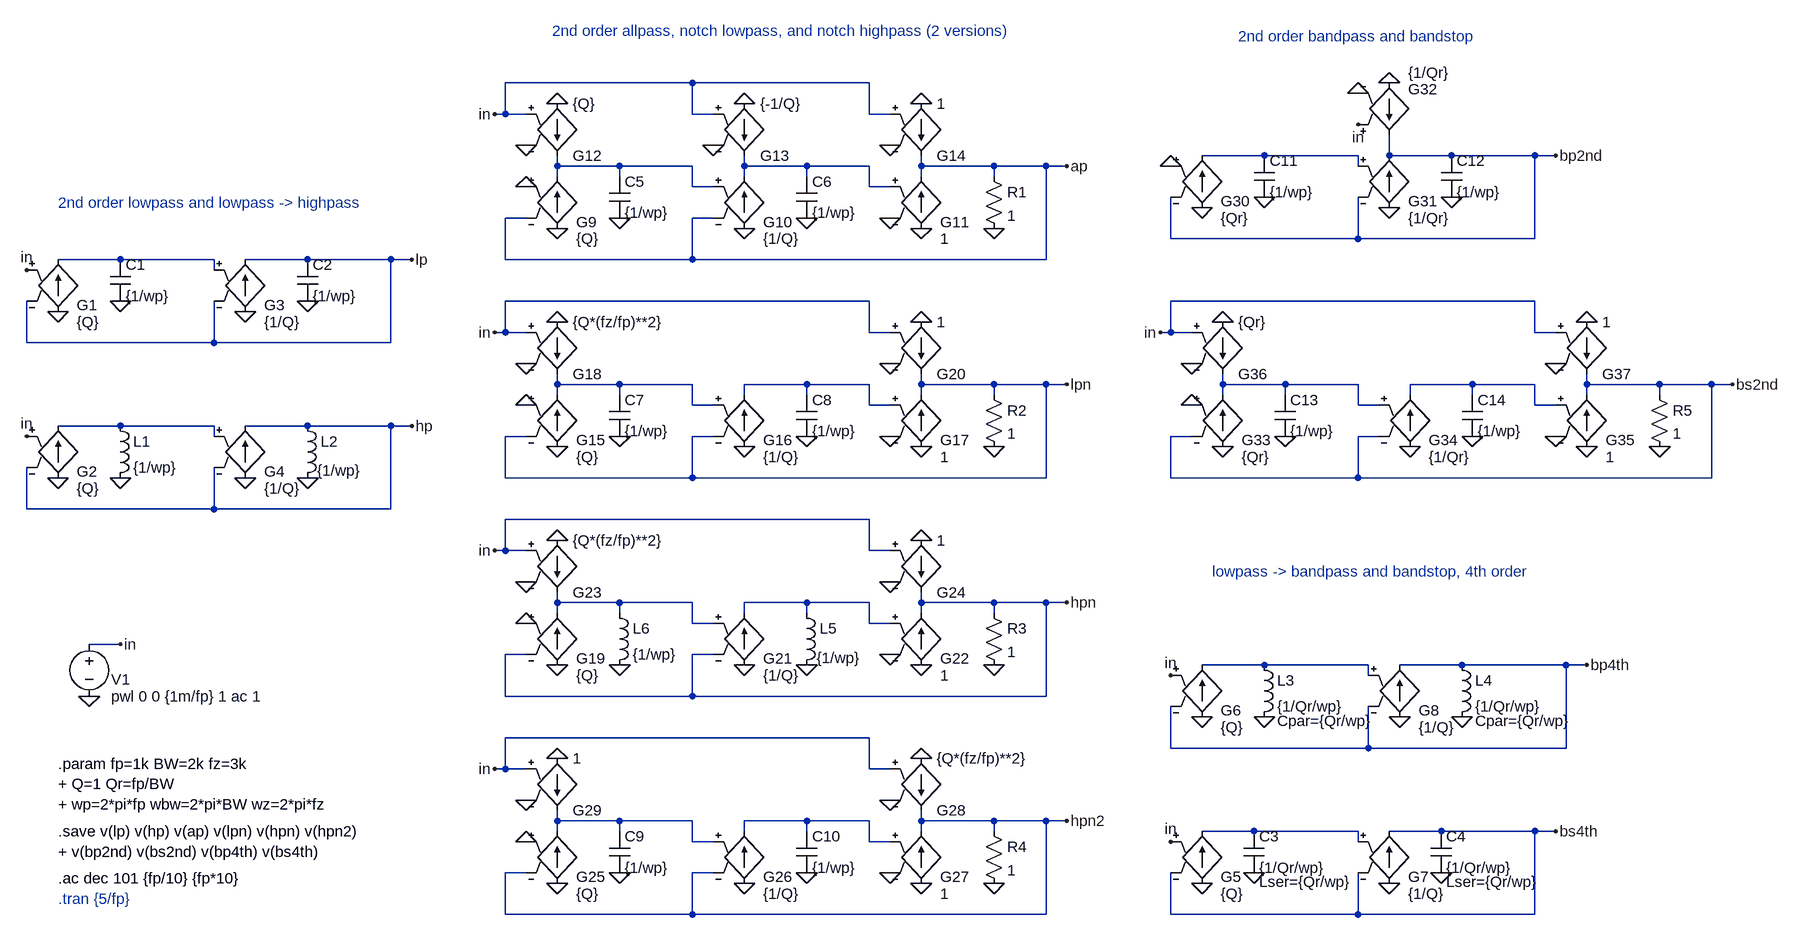
[diagram p0: schematic 2nd_lp,hp,bp,bs,ap.asc]
2nd_lp,hp,bp,bs,ap.asc, the LTspice schematic file:
Version 4
SHEET 1 3596 1400
WIRE 1088 -128 800 -128
WIRE 1360 -128 1088 -128
WIRE 800 -80 800 -128
WIRE 800 -80 784 -80
WIRE 832 -80 800 -80
WIRE 1088 -80 1088 -128
WIRE 1120 -80 1088 -80
WIRE 1360 -80 1360 -128
WIRE 1392 -80 1360 -80
WIRE 1968 -16 1872 -16
WIRE 2112 -16 1968 -16
WIRE 2160 -16 2160 -48
WIRE 2256 -16 2160 -16
WIRE 2384 -16 2256 -16
WIRE 2416 -16 2384 -16
WIRE 880 0 880 -16
WIRE 976 0 880 0
WIRE 1088 0 976 0
WIRE 1168 0 1168 -16
WIRE 1264 0 1168 0
WIRE 1360 0 1264 0
WIRE 1440 0 1440 -16
WIRE 1552 0 1440 0
WIRE 1632 0 1552 0
WIRE 1664 0 1632 0
WIRE 2112 0 2112 -16
WIRE 880 16 880 0
WIRE 976 16 976 0
WIRE 1168 16 1168 0
WIRE 1264 16 1264 0
WIRE 1440 16 1440 0
WIRE 1552 16 1552 0
WIRE 1088 32 1088 0
WIRE 1120 32 1088 32
WIRE 1360 32 1360 0
WIRE 1392 32 1360 32
WIRE 832 80 800 80
WIRE 1120 80 1088 80
WIRE 1824 112 1824 48
WIRE 2112 112 2112 48
WIRE 2112 112 1824 112
WIRE 2384 112 2384 -16
WIRE 2384 112 2112 112
WIRE 208 144 112 144
WIRE 352 144 208 144
WIRE 496 144 400 144
WIRE 624 144 496 144
WIRE 656 144 624 144
WIRE 800 144 800 80
WIRE 1088 144 1088 80
WIRE 1088 144 800 144
WIRE 1632 144 1632 0
WIRE 1632 144 1088 144
WIRE 352 160 352 144
WIRE 1360 208 800 208
WIRE 2384 208 1824 208
WIRE 800 256 800 208
WIRE 800 256 784 256
WIRE 832 256 800 256
WIRE 1360 256 1360 208
WIRE 1392 256 1360 256
WIRE 1824 256 1824 208
WIRE 1824 256 1808 256
WIRE 1856 256 1824 256
WIRE 2384 256 2384 208
WIRE 2416 256 2384 256
WIRE 64 272 64 208
WIRE 352 272 352 208
WIRE 352 272 64 272
WIRE 624 272 624 144
WIRE 624 272 352 272
WIRE 880 336 880 320
WIRE 976 336 880 336
WIRE 1088 336 976 336
WIRE 1264 336 1168 336
WIRE 1360 336 1264 336
WIRE 1440 336 1440 320
WIRE 1552 336 1440 336
WIRE 1632 336 1552 336
WIRE 1664 336 1632 336
WIRE 1904 336 1904 320
WIRE 2000 336 1904 336
WIRE 2112 336 2000 336
WIRE 2288 336 2192 336
WIRE 2384 336 2288 336
WIRE 2464 336 2464 320
WIRE 2576 336 2464 336
WIRE 2656 336 2576 336
WIRE 2688 336 2656 336
WIRE 880 352 880 336
WIRE 976 352 976 336
WIRE 1168 352 1168 336
WIRE 1264 352 1264 336
WIRE 1440 352 1440 336
WIRE 1552 352 1552 336
WIRE 1904 352 1904 336
WIRE 2000 352 2000 336
WIRE 2192 352 2192 336
WIRE 2288 352 2288 336
WIRE 2464 352 2464 336
WIRE 2576 352 2576 336
WIRE 1088 368 1088 336
WIRE 1120 368 1088 368
WIRE 1360 368 1360 336
WIRE 1392 368 1360 368
WIRE 2112 368 2112 336
WIRE 2144 368 2112 368
WIRE 2384 368 2384 336
WIRE 2416 368 2384 368
WIRE 208 400 112 400
WIRE 352 400 208 400
WIRE 496 400 400 400
WIRE 624 400 496 400
WIRE 656 400 624 400
WIRE 352 416 352 400
WIRE 832 416 800 416
WIRE 1120 416 1088 416
WIRE 1856 416 1824 416
WIRE 2144 416 2112 416
WIRE 800 480 800 416
WIRE 1088 480 1088 416
WIRE 1088 480 800 480
WIRE 1632 480 1632 336
WIRE 1632 480 1088 480
WIRE 1824 480 1824 416
WIRE 2112 480 2112 416
WIRE 2112 480 1824 480
WIRE 2656 480 2656 336
WIRE 2656 480 2112 480
WIRE 64 528 64 464
WIRE 352 528 352 464
WIRE 352 528 64 528
WIRE 624 528 624 400
WIRE 624 528 352 528
WIRE 1360 544 800 544
WIRE 800 592 800 544
WIRE 800 592 784 592
WIRE 832 592 800 592
WIRE 1360 592 1360 544
WIRE 1392 592 1360 592
WIRE 880 672 880 656
WIRE 976 672 880 672
WIRE 1088 672 976 672
WIRE 1264 672 1168 672
WIRE 1360 672 1264 672
WIRE 1440 672 1440 656
WIRE 1552 672 1440 672
WIRE 1632 672 1552 672
WIRE 1664 672 1632 672
WIRE 880 688 880 672
WIRE 976 688 976 672
WIRE 1168 688 1168 672
WIRE 1264 688 1264 672
WIRE 1440 688 1440 672
WIRE 1552 688 1552 672
WIRE 1088 704 1088 672
WIRE 1120 704 1088 704
WIRE 1360 704 1360 672
WIRE 1392 704 1360 704
WIRE 208 736 160 736
WIRE 832 752 800 752
WIRE 1120 752 1088 752
WIRE 1968 768 1872 768
WIRE 2128 768 1968 768
WIRE 2272 768 2176 768
WIRE 2432 768 2272 768
WIRE 2464 768 2432 768
WIRE 2128 784 2128 768
WIRE 800 816 800 752
WIRE 1088 816 1088 752
WIRE 1088 816 800 816
WIRE 1632 816 1632 672
WIRE 1632 816 1088 816
WIRE 1360 880 800 880
WIRE 1824 896 1824 832
WIRE 2128 896 2128 832
WIRE 2128 896 1824 896
WIRE 2432 896 2432 768
WIRE 2432 896 2128 896
WIRE 800 928 800 880
WIRE 800 928 784 928
WIRE 832 928 800 928
WIRE 1360 928 1360 880
WIRE 1392 928 1360 928
WIRE 880 1008 880 992
WIRE 976 1008 880 1008
WIRE 1088 1008 976 1008
WIRE 1264 1008 1168 1008
WIRE 1360 1008 1264 1008
WIRE 1440 1008 1440 992
WIRE 1552 1008 1440 1008
WIRE 1632 1008 1552 1008
WIRE 1664 1008 1632 1008
WIRE 880 1024 880 1008
WIRE 976 1024 976 1008
WIRE 1168 1024 1168 1008
WIRE 1264 1024 1264 1008
WIRE 1440 1024 1440 1008
WIRE 1552 1024 1552 1008
WIRE 1952 1024 1872 1024
WIRE 2112 1024 1952 1024
WIRE 2240 1024 2160 1024
WIRE 2384 1024 2240 1024
WIRE 2416 1024 2384 1024
WIRE 1088 1040 1088 1008
WIRE 1120 1040 1088 1040
WIRE 1360 1040 1360 1008
WIRE 1392 1040 1360 1040
WIRE 2112 1040 2112 1024
WIRE 832 1088 800 1088
WIRE 1120 1088 1088 1088
WIRE 800 1152 800 1088
WIRE 1088 1152 1088 1088
WIRE 1088 1152 800 1152
WIRE 1632 1152 1632 1008
WIRE 1632 1152 1088 1152
WIRE 1824 1152 1824 1088
WIRE 2112 1152 2112 1088
WIRE 2112 1152 1824 1152
WIRE 2384 1152 2384 1024
WIRE 2384 1152 2112 1152
FLAG 208 208 0
FLAG 112 224 0
FLAG 160 816 0
FLAG 208 480 0
FLAG 112 480 0
FLAG 208 736 in
FLAG 656 144 lp
FLAG 496 208 0
FLAG 400 224 0
FLAG 64 160 in
FLAG 64 416 in
FLAG 656 400 hp
FLAG 496 480 0
FLAG 400 480 0
FLAG 1952 1088 0
FLAG 1872 1104 0
FLAG 1968 848 0
FLAG 1872 848 0
FLAG 2464 768 bp4th
FLAG 2240 1088 0
FLAG 2160 1104 0
FLAG 1824 1040 in
FLAG 1824 784 in
FLAG 2416 1024 bs4th
FLAG 2272 848 0
FLAG 2176 848 0
FLAG 976 80 0
FLAG 880 96 0
FLAG 1664 0 ap
FLAG 1264 80 0
FLAG 1168 96 0
FLAG 784 -80 in
FLAG 1440 96 0
FLAG 1552 96 0
FLAG 832 -32 0
FLAG 880 -96 0
FLAG 1120 -32 0
FLAG 1168 -96 0
FLAG 1392 -32 0
FLAG 1440 -96 0
FLAG 832 32 0
FLAG 1392 80 0
FLAG 976 416 0
FLAG 880 432 0
FLAG 1664 336 lpn
FLAG 1264 416 0
FLAG 1168 432 0
FLAG 784 256 in
FLAG 1440 432 0
FLAG 1552 432 0
FLAG 832 304 0
FLAG 880 240 0
FLAG 1392 304 0
FLAG 1440 240 0
FLAG 832 368 0
FLAG 1392 416 0
FLAG 976 768 0
FLAG 880 768 0
FLAG 1664 672 hpn
FLAG 1264 768 0
FLAG 1168 768 0
FLAG 784 592 in
FLAG 1440 768 0
FLAG 1552 768 0
FLAG 832 640 0
FLAG 880 576 0
FLAG 1392 640 0
FLAG 1440 576 0
FLAG 832 704 0
FLAG 1392 752 0
FLAG 976 1088 0
FLAG 880 1104 0
FLAG 1264 1088 0
FLAG 1168 1104 0
FLAG 784 928 in
FLAG 1440 1104 0
FLAG 1552 1104 0
FLAG 832 976 0
FLAG 880 912 0
FLAG 1392 976 0
FLAG 1440 912 0
FLAG 832 1040 0
FLAG 1392 1088 0
FLAG 1664 1008 hpn2
FLAG 1968 48 0
FLAG 1872 64 0
FLAG 2416 -16 bp2nd
FLAG 2256 48 0
FLAG 2160 64 0
FLAG 2112 -64 in
FLAG 2112 -112 0
FLAG 2160 -128 0
FLAG 1824 0 0
FLAG 2000 416 0
FLAG 1904 432 0
FLAG 2688 336 bs2nd
FLAG 2288 416 0
FLAG 2192 432 0
FLAG 1808 256 in
FLAG 2464 432 0
FLAG 2576 432 0
FLAG 1856 304 0
FLAG 1904 240 0
FLAG 2416 304 0
FLAG 2464 240 0
FLAG 1856 368 0
FLAG 2416 416 0
SYMBOL g 112 128 R0
WINDOW 0 29 86 Left 2
WINDOW 3 29 112 Left 2
SYMATTR InstName G1
SYMATTR Value {Q}
SYMBOL cap 192 144 R0
SYMATTR Value2 Rpar=1g
SYMATTR InstName C1
SYMATTR Value {1/wp}
SYMBOL voltage 160 720 R0
WINDOW 0 34 70 Left 2
WINDOW 3 34 96 Left 2
SYMATTR InstName V1
SYMATTR Value pwl 0 0 {1m/fp} 1 ac 1
SYMBOL g 112 384 R0
WINDOW 0 29 86 Left 2
WINDOW 3 29 112 Left 2
SYMATTR InstName G2
SYMATTR Value {Q}
SYMBOL ind 192 384 R0
SYMATTR Value2 Rser=0
SYMATTR InstName L1
SYMATTR Value {1/wp}
SYMBOL g 400 128 R0
WINDOW 0 29 86 Left 2
WINDOW 3 29 112 Left 2
SYMATTR InstName G3
SYMATTR Value {1/Q}
SYMBOL cap 480 144 R0
SYMATTR Value2 Rpar=1g
SYMATTR InstName C2
SYMATTR Value {1/wp}
SYMBOL g 400 384 R0
WINDOW 0 29 86 Left 2
WINDOW 3 29 112 Left 2
SYMATTR InstName G4
SYMATTR Value {1/Q}
SYMBOL ind 480 384 R0
WINDOW 3 31 85 Left 2
SYMATTR Value {1/wp}
SYMATTR Value2 Rser=0
SYMATTR InstName L2
SYMBOL g 1872 1008 R0
WINDOW 0 29 86 Left 2
WINDOW 3 29 112 Left 2
SYMATTR InstName G5
SYMATTR Value {Q}
SYMBOL cap 1936 1024 R0
WINDOW 123 24 78 Left 2
SYMATTR Value2 Lser={Qr/wp}
SYMATTR InstName C3
SYMATTR Value {1/Qr/wp}
SYMATTR SpiceLine Rpar=1g
SYMBOL g 1872 752 R0
WINDOW 0 29 86 Left 2
WINDOW 3 29 112 Left 2
SYMATTR InstName G6
SYMATTR Value {Q}
SYMBOL ind 1952 752 R0
WINDOW 123 36 102 Left 2
SYMATTR Value2 Cpar={Qr/wp}
SYMATTR InstName L3
SYMATTR Value {1/Qr/wp}
SYMATTR SpiceLine Rser=0
SYMBOL g 2160 1008 R0
WINDOW 0 29 86 Left 2
WINDOW 3 29 112 Left 2
SYMATTR InstName G7
SYMATTR Value {1/Q}
SYMBOL g 2176 752 R0
WINDOW 0 29 86 Left 2
WINDOW 3 29 112 Left 2
SYMATTR InstName G8
SYMATTR Value {1/Q}
SYMBOL cap 2224 1024 R0
WINDOW 123 24 78 Left 2
SYMATTR Value2 Lser={Qr/wp}
SYMATTR InstName C4
SYMATTR Value {1/Qr/wp}
SYMATTR SpiceLine Rpar=1g
SYMBOL ind 2256 752 R0
WINDOW 123 36 102 Left 2
SYMATTR Value2 Cpar={Qr/wp}
SYMATTR InstName L4
SYMATTR Value {1/Qr/wp}
SYMATTR SpiceLine Rser=0
SYMBOL g 880 0 R0
WINDOW 0 29 86 Left 2
WINDOW 3 29 112 Left 2
SYMATTR InstName G9
SYMATTR Value {Q}
SYMBOL cap 960 16 R0
SYMATTR Value2 Rpar=1g
SYMATTR InstName C5
SYMATTR Value {1/wp}
SYMBOL g 1168 0 R0
WINDOW 0 29 86 Left 2
WINDOW 3 29 112 Left 2
SYMATTR InstName G10
SYMATTR Value {1/Q}
SYMBOL cap 1248 16 R0
SYMATTR Value2 Rpar=1g
SYMATTR InstName C6
SYMATTR Value {1/wp}
SYMBOL g 1440 0 R0
WINDOW 0 29 86 Left 2
WINDOW 3 29 112 Left 2
SYMATTR InstName G11
SYMATTR Value 1
SYMBOL res 1536 0 R0
SYMATTR InstName R1
SYMATTR Value 1
SYMBOL g2 880 0 M180
SYMATTR InstName G12
SYMATTR Value {Q}
SYMBOL g2 1168 0 M180
SYMATTR InstName G13
SYMATTR Value {-1/Q}
SYMBOL g2 1440 0 M180
SYMATTR InstName G14
SYMATTR Value 1
SYMBOL g 880 336 R0
WINDOW 0 29 86 Left 2
WINDOW 3 29 112 Left 2
SYMATTR InstName G15
SYMATTR Value {Q}
SYMBOL cap 960 352 R0
SYMATTR Value2 Rpar=1g
SYMATTR InstName C7
SYMATTR Value {1/wp}
SYMBOL g 1168 336 R0
WINDOW 0 29 86 Left 2
WINDOW 3 29 112 Left 2
SYMATTR InstName G16
SYMATTR Value {1/Q}
SYMBOL cap 1248 352 R0
SYMATTR Value2 Rpar=1g
SYMATTR InstName C8
SYMATTR Value {1/wp}
SYMBOL g 1440 336 R0
WINDOW 0 29 86 Left 2
WINDOW 3 29 112 Left 2
SYMATTR InstName G17
SYMATTR Value 1
SYMBOL res 1536 336 R0
SYMATTR InstName R2
SYMATTR Value 1
SYMBOL g2 880 336 M180
SYMATTR InstName G18
SYMATTR Value {Q*(fz/fp)**2}
SYMBOL g2 1440 336 M180
SYMATTR InstName G20
SYMATTR Value 1
SYMBOL g 880 672 R0
WINDOW 0 29 86 Left 2
WINDOW 3 29 112 Left 2
SYMATTR InstName G19
SYMATTR Value {Q}
SYMBOL g 1168 672 R0
WINDOW 0 29 86 Left 2
WINDOW 3 29 112 Left 2
SYMATTR InstName G21
SYMATTR Value {1/Q}
SYMBOL g 1440 672 R0
WINDOW 0 29 86 Left 2
WINDOW 3 29 112 Left 2
SYMATTR InstName G22
SYMATTR Value 1
SYMBOL res 1536 672 R0
SYMATTR InstName R3
SYMATTR Value 1
SYMBOL g2 880 672 M180
SYMATTR InstName G23
SYMATTR Value {Q*(fz/fp)**2}
SYMBOL g2 1440 672 M180
SYMATTR InstName G24
SYMATTR Value 1
SYMBOL ind 1248 672 R0
WINDOW 3 31 85 Left 2
SYMATTR Value {1/wp}
SYMATTR Value2 Rser=0
SYMATTR InstName L5
SYMBOL ind 960 672 R0
SYMATTR Value2 Rser=0
SYMATTR InstName L6
SYMATTR Value {1/wp}
SYMBOL g 880 1008 R0
WINDOW 0 29 86 Left 2
WINDOW 3 29 112 Left 2
SYMATTR InstName G25
SYMATTR Value {Q}
SYMBOL cap 960 1024 R0
SYMATTR Value2 Rpar=1g
SYMATTR InstName C9
SYMATTR Value {1/wp}
SYMBOL g 1168 1008 R0
WINDOW 0 29 86 Left 2
WINDOW 3 29 112 Left 2
SYMATTR InstName G26
SYMATTR Value {1/Q}
SYMBOL cap 1248 1024 R0
SYMATTR Value2 Rpar=1g
SYMATTR InstName C10
SYMATTR Value {1/wp}
SYMBOL g 1440 1008 R0
WINDOW 0 29 86 Left 2
WINDOW 3 29 112 Left 2
SYMATTR InstName G27
SYMATTR Value 1
SYMBOL res 1536 1008 R0
SYMATTR InstName R4
SYMATTR Value 1
SYMBOL g2 1440 1008 M180
SYMATTR InstName G28
SYMATTR Value {Q*(fz/fp)**2}
SYMBOL g2 880 1008 M180
SYMATTR InstName G29
SYMATTR Value 1
SYMBOL g 1872 -32 R0
WINDOW 0 29 86 Left 2
WINDOW 3 29 112 Left 2
SYMATTR InstName G30
SYMATTR Value {Qr}
SYMBOL cap 1952 -16 R0
SYMATTR Value2 Rpar=1g
SYMATTR InstName C11
SYMATTR Value {1/wp}
SYMBOL g 2160 -32 R0
WINDOW 0 29 86 Left 2
WINDOW 3 29 112 Left 2
SYMATTR InstName G31
SYMATTR Value {1/Qr}
SYMBOL cap 2240 -16 R0
SYMATTR Value2 Rpar=1g
SYMATTR InstName C12
SYMATTR Value {1/wp}
SYMBOL g 2160 -32 M180
WINDOW 0 29 86 Left 2
WINDOW 3 29 112 Left 2
SYMATTR InstName G32
SYMATTR Value {1/Qr}
SYMBOL g 1904 336 R0
WINDOW 0 29 86 Left 2
WINDOW 3 29 112 Left 2
SYMATTR InstName G33
SYMATTR Value {Qr}
SYMBOL cap 1984 352 R0
SYMATTR Value2 Rpar=1g
SYMATTR InstName C13
SYMATTR Value {1/wp}
SYMBOL g 2192 336 R0
WINDOW 0 29 86 Left 2
WINDOW 3 29 112 Left 2
SYMATTR InstName G34
SYMATTR Value {1/Qr}
SYMBOL cap 2272 352 R0
SYMATTR Value2 Rpar=1g
SYMATTR InstName C14
SYMATTR Value {1/wp}
SYMBOL g 2464 336 R0
WINDOW 0 29 86 Left 2
WINDOW 3 29 112 Left 2
SYMATTR InstName G35
SYMATTR Value 1
SYMBOL res 2560 336 R0
SYMATTR InstName R5
SYMATTR Value 1
SYMBOL g2 1904 336 M180
SYMATTR InstName G36
SYMATTR Value {Qr}
SYMBOL g2 2464 336 M180
SYMATTR InstName G37
SYMATTR Value 1
TEXT 112 920 Left 2 !.param fp=1k BW=2k fz=3k\n+ Q=1 Qr=fp/BW\n+ wp=2*pi*fp wbw=2*pi*BW wz=2*pi*fz
TEXT 112 1096 Left 2 !.ac dec 101 {fp/10} {fp*10}
TEXT 112 56 Left 2 ;2nd order lowpass and lowpass -> highpass
TEXT 872 -208 Left 2 ;2nd order allpass, notch lowpass, and notch highpass (2 versions)
TEXT 1928 -200 Left 2 ;2nd order bandpass and bandstop
TEXT 1888 624 Left 2 ;lowpass -> bandpass and bandstop, 4th order
TEXT 112 1128 Left 2 ;.tran {5/fp}
TEXT 112 1024 Left 2 !.save v(lp) v(hp) v(ap) v(lpn) v(hpn) v(hpn2)\n+ v(bp2nd) v(bs2nd) v(bp4th) v(bs4th)

The netlist it stands for:
* 2nd_lp,hp,bp,bs,ap.asc
G1 0 N004 in lp {Q}
C1 N004 0 {1/wp} Rpar=1g
V1 in 0 pwl 0 0 {1m/fp} 1 ac 1
G2 0 N009 in hp {Q}
L1 N009 0 {1/wp} Rser=0
G3 0 lp N004 lp {1/Q}
C2 lp 0 {1/wp} Rpar=1g
G4 0 hp N009 hp {1/Q}
L2 hp 0 {1/wp} Rser=0
G5 0 N015 in bs4th {Q}
C3 N015 0 {1/Qr/wp} Lser={Qr/wp} Rpar=1g
G6 0 N012 in bp4th {Q}
L3 N012 0 {1/Qr/wp} Cpar={Qr/wp} Rser=0
G7 0 bs4th N015 bs4th {1/Q}
G8 0 bp4th N012 bp4th {1/Q}
C4 bs4th 0 {1/Qr/wp} Lser={Qr/wp} Rpar=1g
L4 bp4th 0 {1/Qr/wp} Cpar={Qr/wp} Rser=0
G9 0 N002 0 ap {Q}
C5 N002 0 {1/wp} Rpar=1g
G10 0 N003 N002 ap {1/Q}
C6 N003 0 {1/wp} Rpar=1g
G11 0 ap N003 0 1
R1 ap 0 1
G12 0 N002 in 0 {Q}
G13 0 N003 in 0 {-1/Q}
G14 0 ap in 0 1
G15 0 N005 0 lpn {Q}
C7 N005 0 {1/wp} Rpar=1g
G16 0 N006 N005 lpn {1/Q}
C8 N006 0 {1/wp} Rpar=1g
G17 0 lpn N006 0 1
R2 lpn 0 1
G18 0 N005 in 0 {Q*(fz/fp)**2}
G20 0 lpn in 0 1
G19 0 N010 0 hpn {Q}
G21 0 N011 N010 hpn {1/Q}
G22 0 hpn N011 0 1
R3 hpn 0 1
G23 0 N010 in 0 {Q*(fz/fp)**2}
G24 0 hpn in 0 1
L5 N011 0 {1/wp} Rser=0
L6 N010 0 {1/wp} Rser=0
G25 0 N013 0 hpn2 {Q}
C9 N013 0 {1/wp} Rpar=1g
G26 0 N014 N013 hpn2 {1/Q}
C10 N014 0 {1/wp} Rpar=1g
G27 0 hpn2 N014 0 1
R4 hpn2 0 1
G28 0 hpn2 in 0 {Q*(fz/fp)**2}
G29 0 N013 in 0 1
G30 0 N001 0 bp2nd {Qr}
C11 N001 0 {1/wp} Rpar=1g
G31 0 bp2nd N001 bp2nd {1/Qr}
C12 bp2nd 0 {1/wp} Rpar=1g
G32 0 bp2nd in 0 {1/Qr}
G33 0 N007 0 bs2nd {Qr}
C13 N007 0 {1/wp} Rpar=1g
G34 0 N008 N007 bs2nd {1/Qr}
C14 N008 0 {1/wp} Rpar=1g
G35 0 bs2nd N008 0 1
R5 bs2nd 0 1
G36 0 N007 in 0 {Qr}
G37 0 bs2nd in 0 1
.param fp=1k BW=2k fz=3k
+ Q=1 Qr=fp/BW
+ wp=2*pi*fp wbw=2*pi*BW wz=2*pi*fz
.ac dec 101 {fp/10} {fp*10}
* 2nd order lowpass and lowpass -> highpass
* 2nd order allpass, notch lowpass, and notch highpass (2 versions)
* 2nd order bandpass and bandstop
* lowpass -> bandpass and bandstop, 4th order
* .tran {5/fp}
.save v(lp) v(hp) v(ap) v(lpn) v(hpn) v(hpn2)
+ v(bp2nd) v(bs2nd) v(bp4th) v(bs4th)
.backanno
.end